# Altium schematic sheet Connectors.SchDoc
size A4
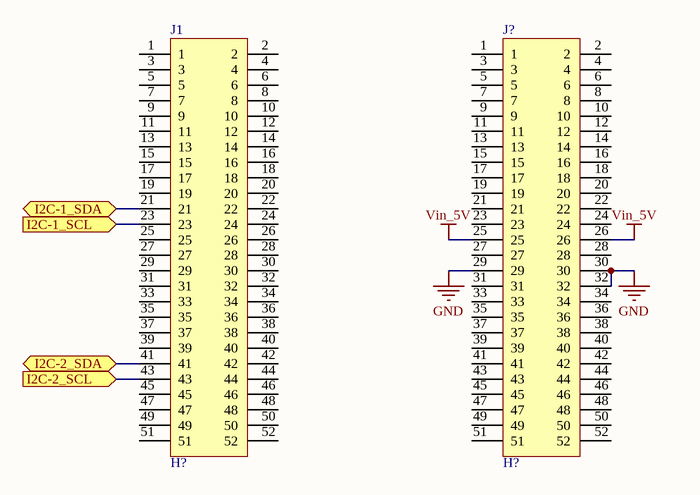
[diagram p0: Connectors.SchDoc]

## Parts
J1  H?  [ESQ_26]
J?  H?  [ESQ_26]

## Ports
I2C-1_SCL (in), I2C-1_SDA (bidir), I2C-2_SCL (in), I2C-2_SDA (bidir)

## Nets
GND: J?.29 J?.30 J?.32
Vin_5V: J?.25 J?.26
I2C-1_SCL: J1.23 ; port I2C-1_SCL
I2C-1_SDA: J1.21 ; port I2C-1_SDA
I2C-2_SCL: J1.43 ; port I2C-2_SCL
I2C-2_SDA: J1.41 ; port I2C-2_SDA

Not connected (* = marked no-connect by the designer): J1 1 2 3 4 5 6 7 8 9 10 11 12 13 14 15 16 17 18 19 20 22 24 25 26 27 28 29 30 31 32 33 34 35 36 37 38 39 40 42 44 45 46 47 48 49 50 51 52; J? 1 2 3 4 5 6 7 8 9 10 11 12 13 14 15 16 17 18 19 20 21 22 23 24 27 28 31 33 34 35 36 37 38 39 40 41 42 43 44 45 46 47 48 49 50 51 52

## Library data of the parts
J1 J? = ESQ_126_49_GD: eVendor: *; eVendor Part#: *; eVendor Price: *; Manufacturer: *; MOQ: *; MSRP: *; Part#: *